# EAGLE schematic A10-A20-OLINUXINO-MICRO-4GB_Rev_D (EAGLE 6.6.0), part 1 of 2
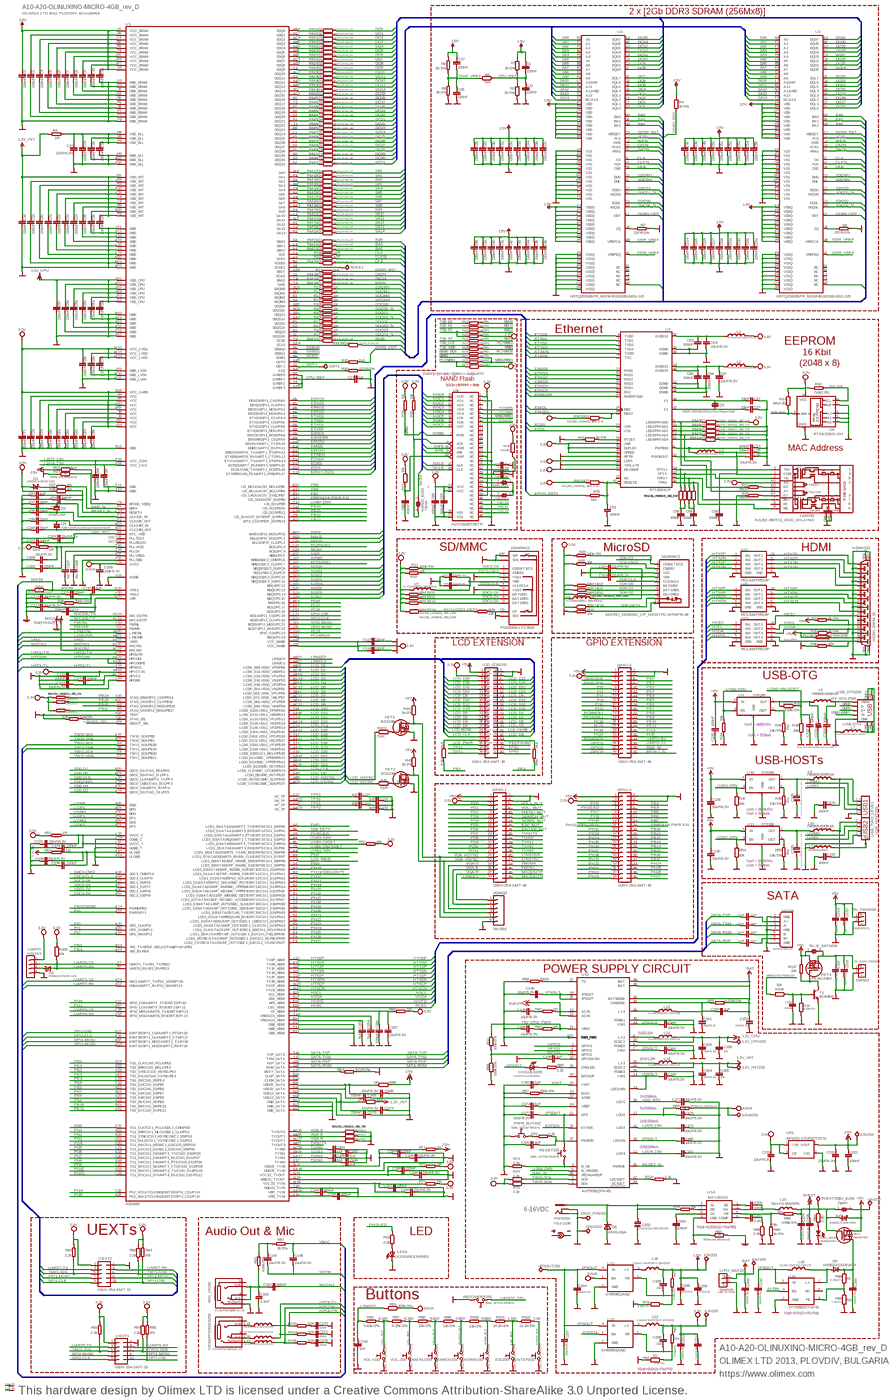
[diagram p0: schematic, sheet 1, overview]
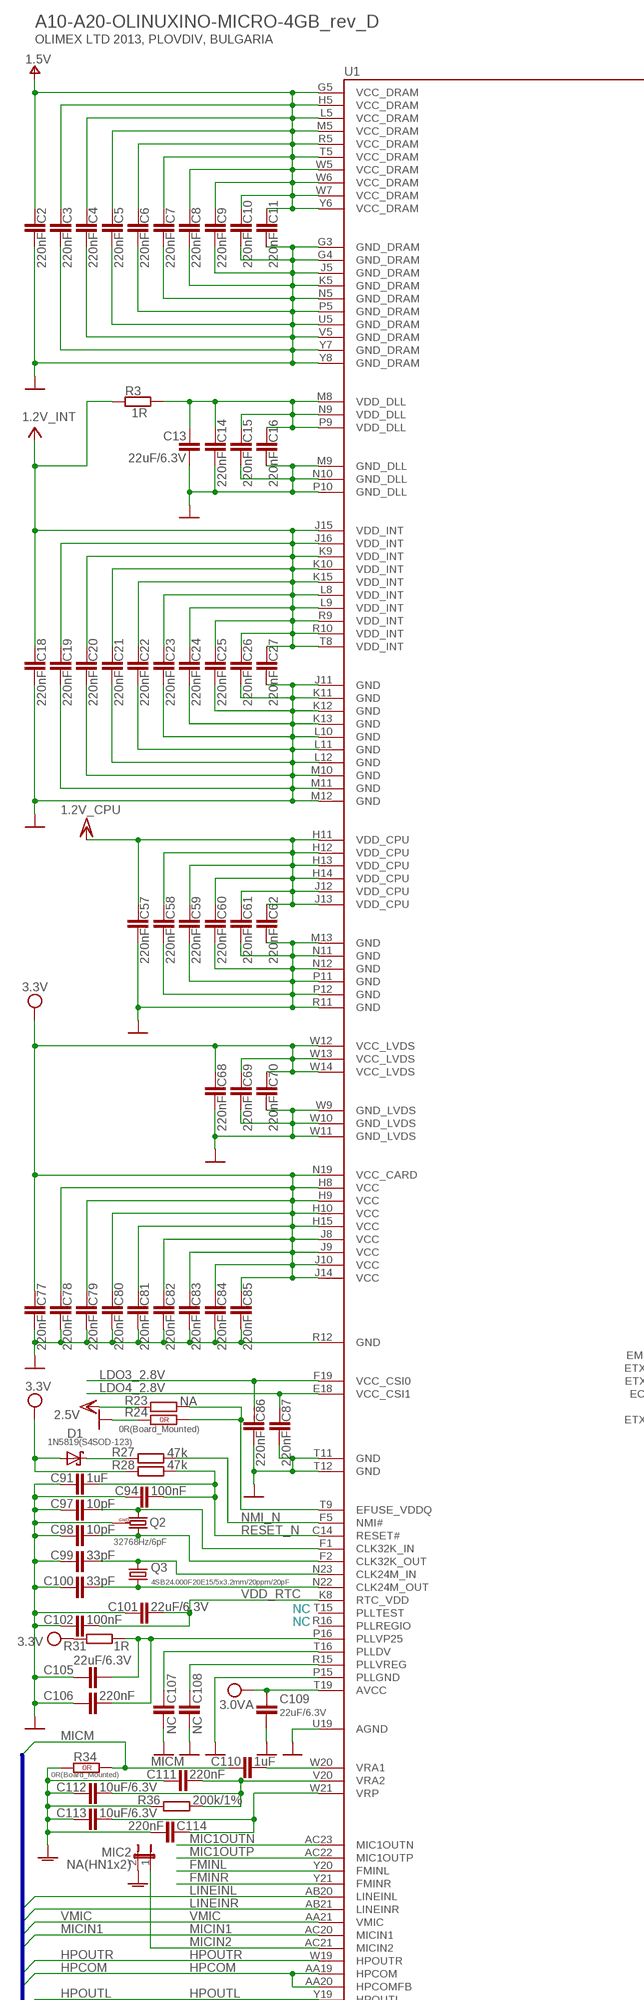
[diagram p1: schematic, sheet 1, part 1 of 4]
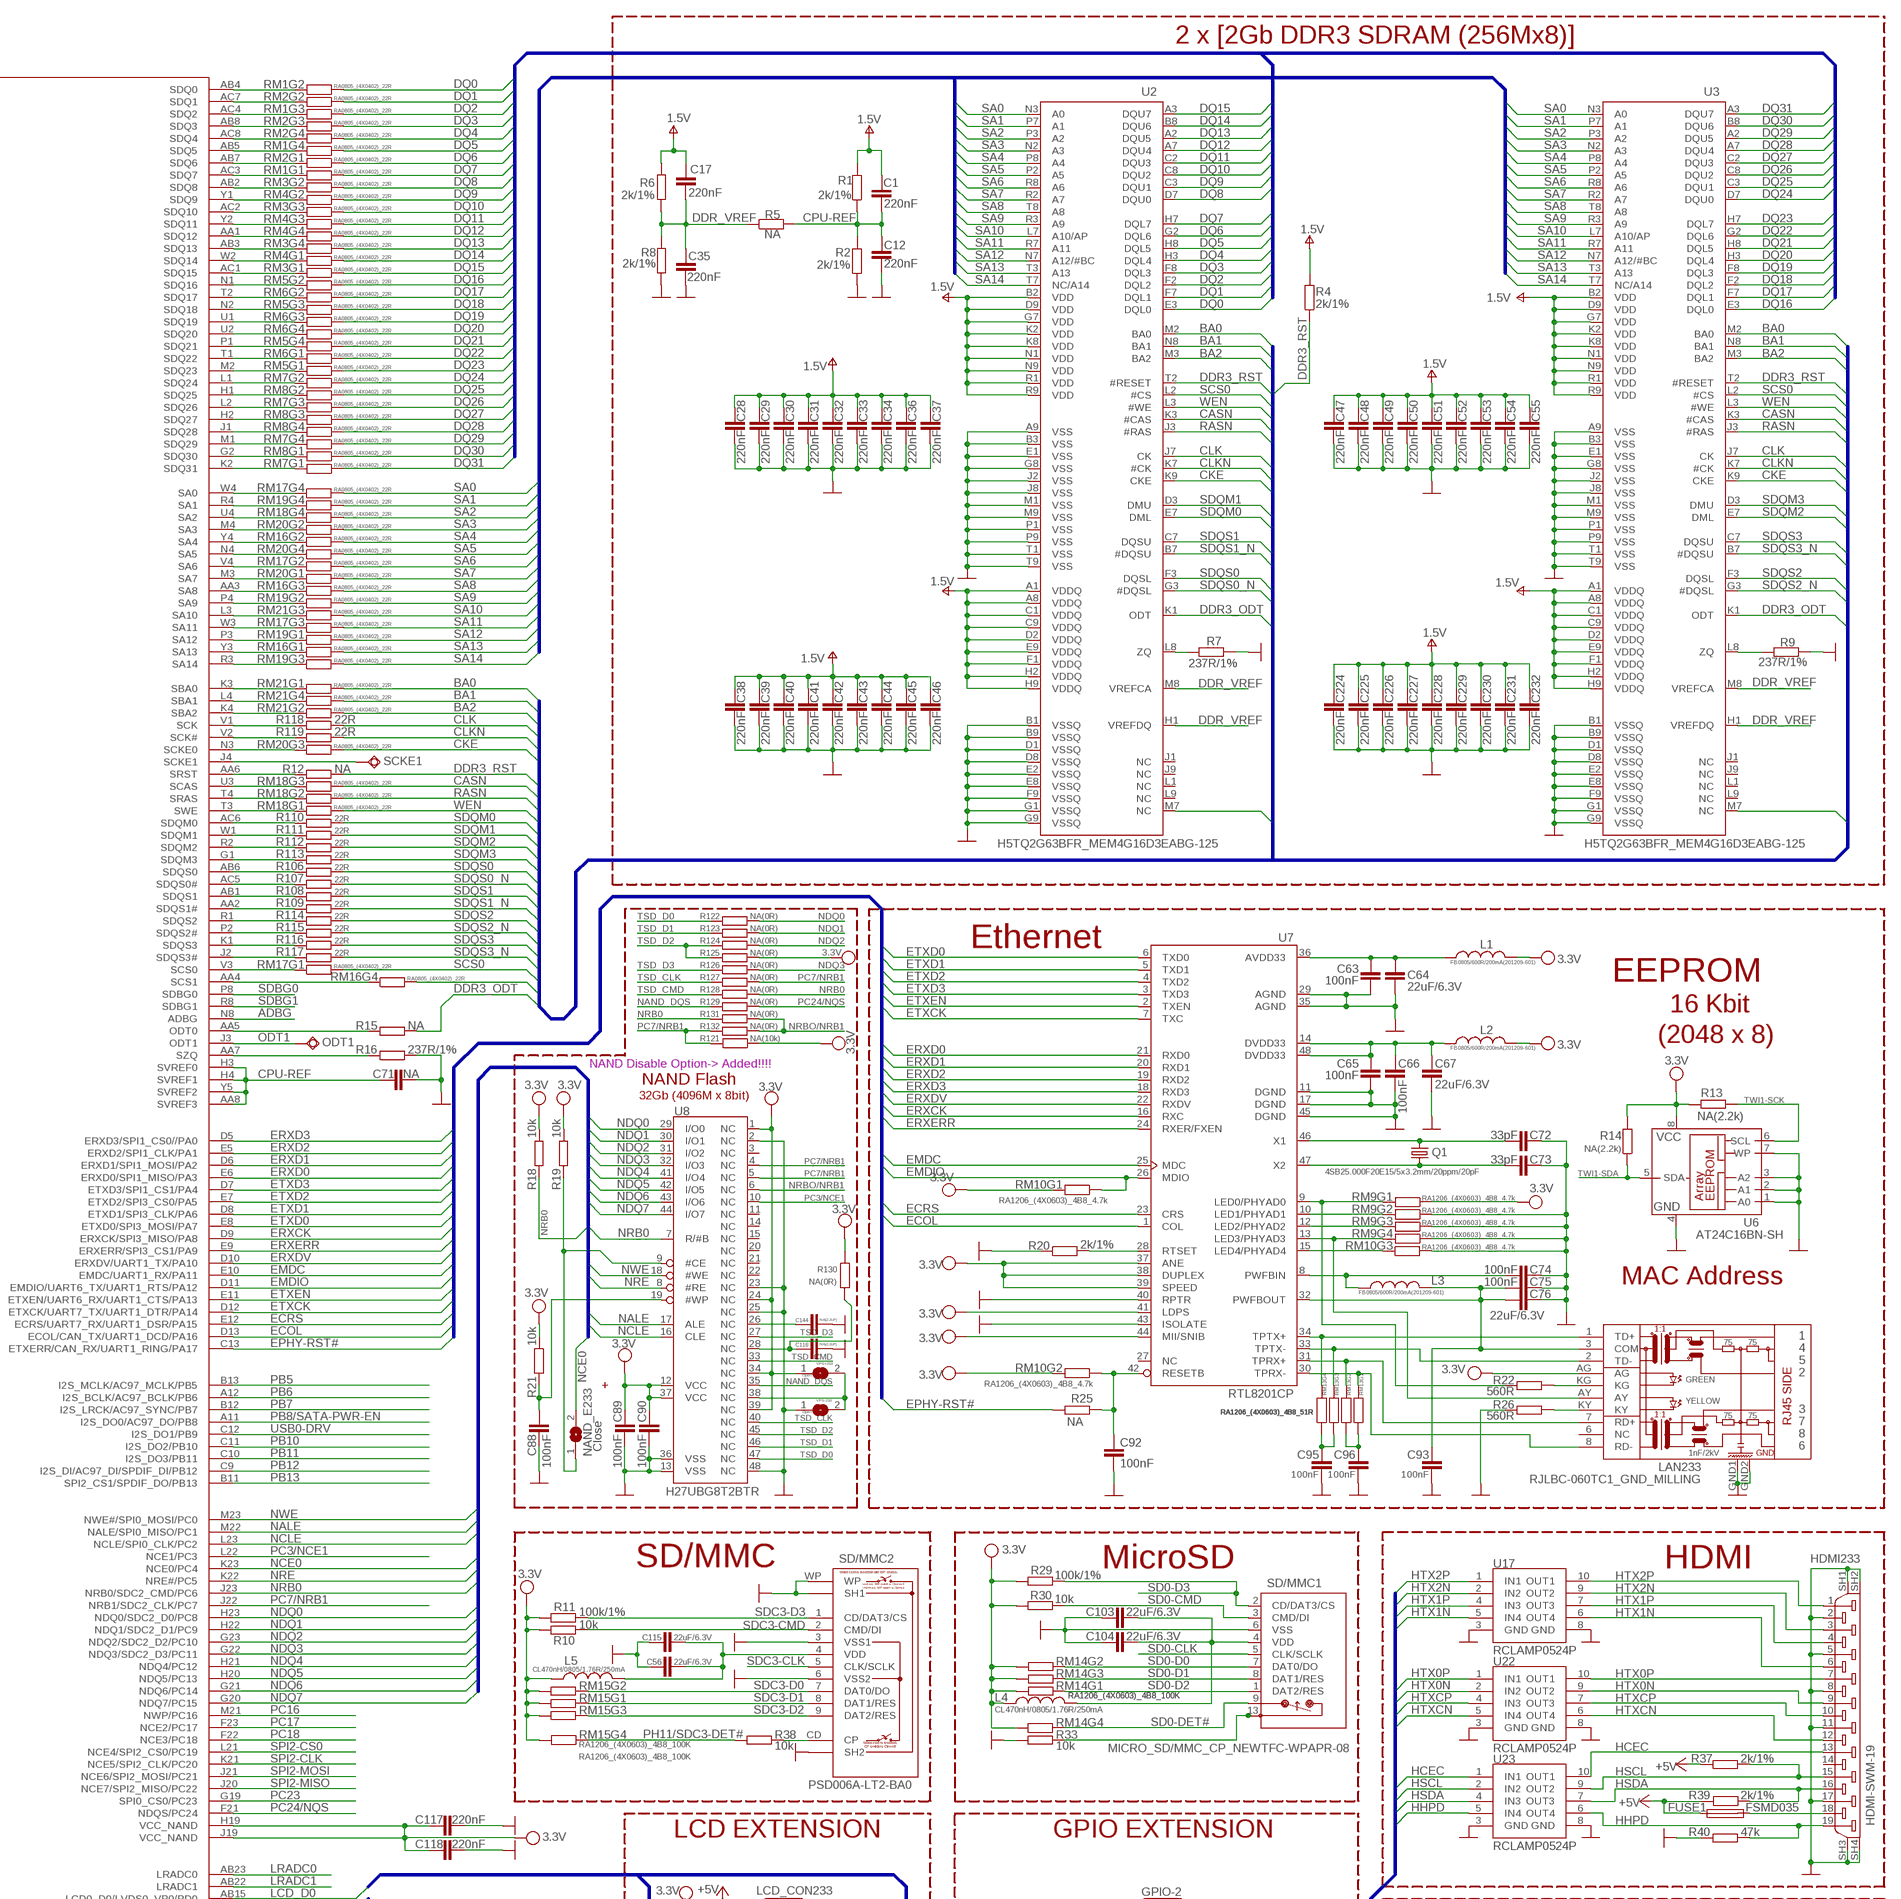
[diagram p2: schematic, sheet 1, part 2 of 4]
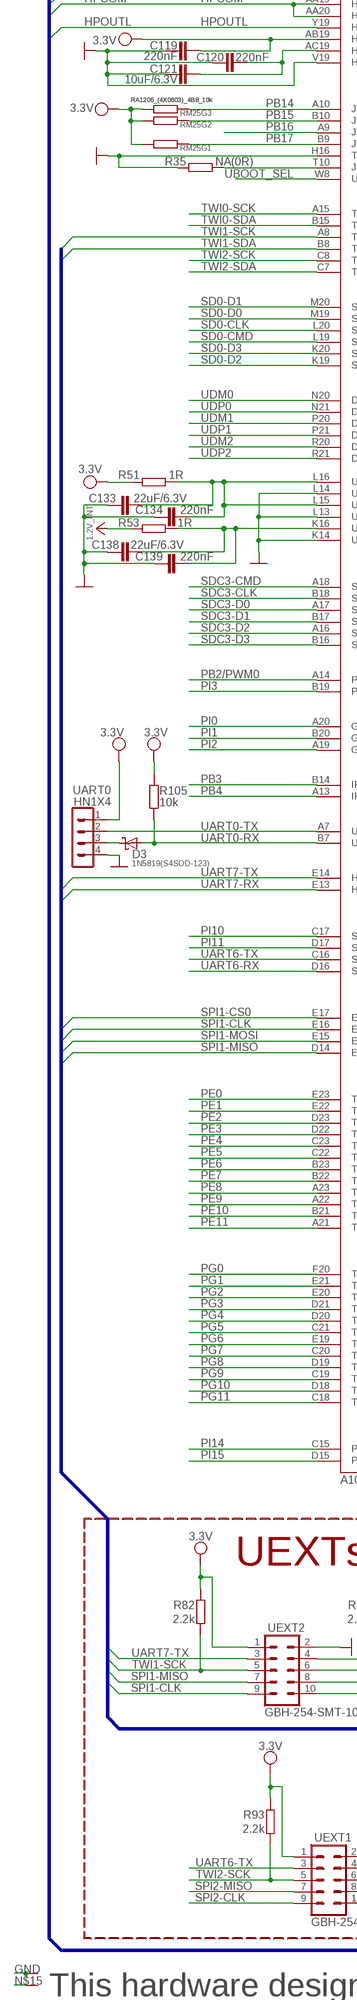
[diagram p3: schematic, sheet 1, part 3 of 4]
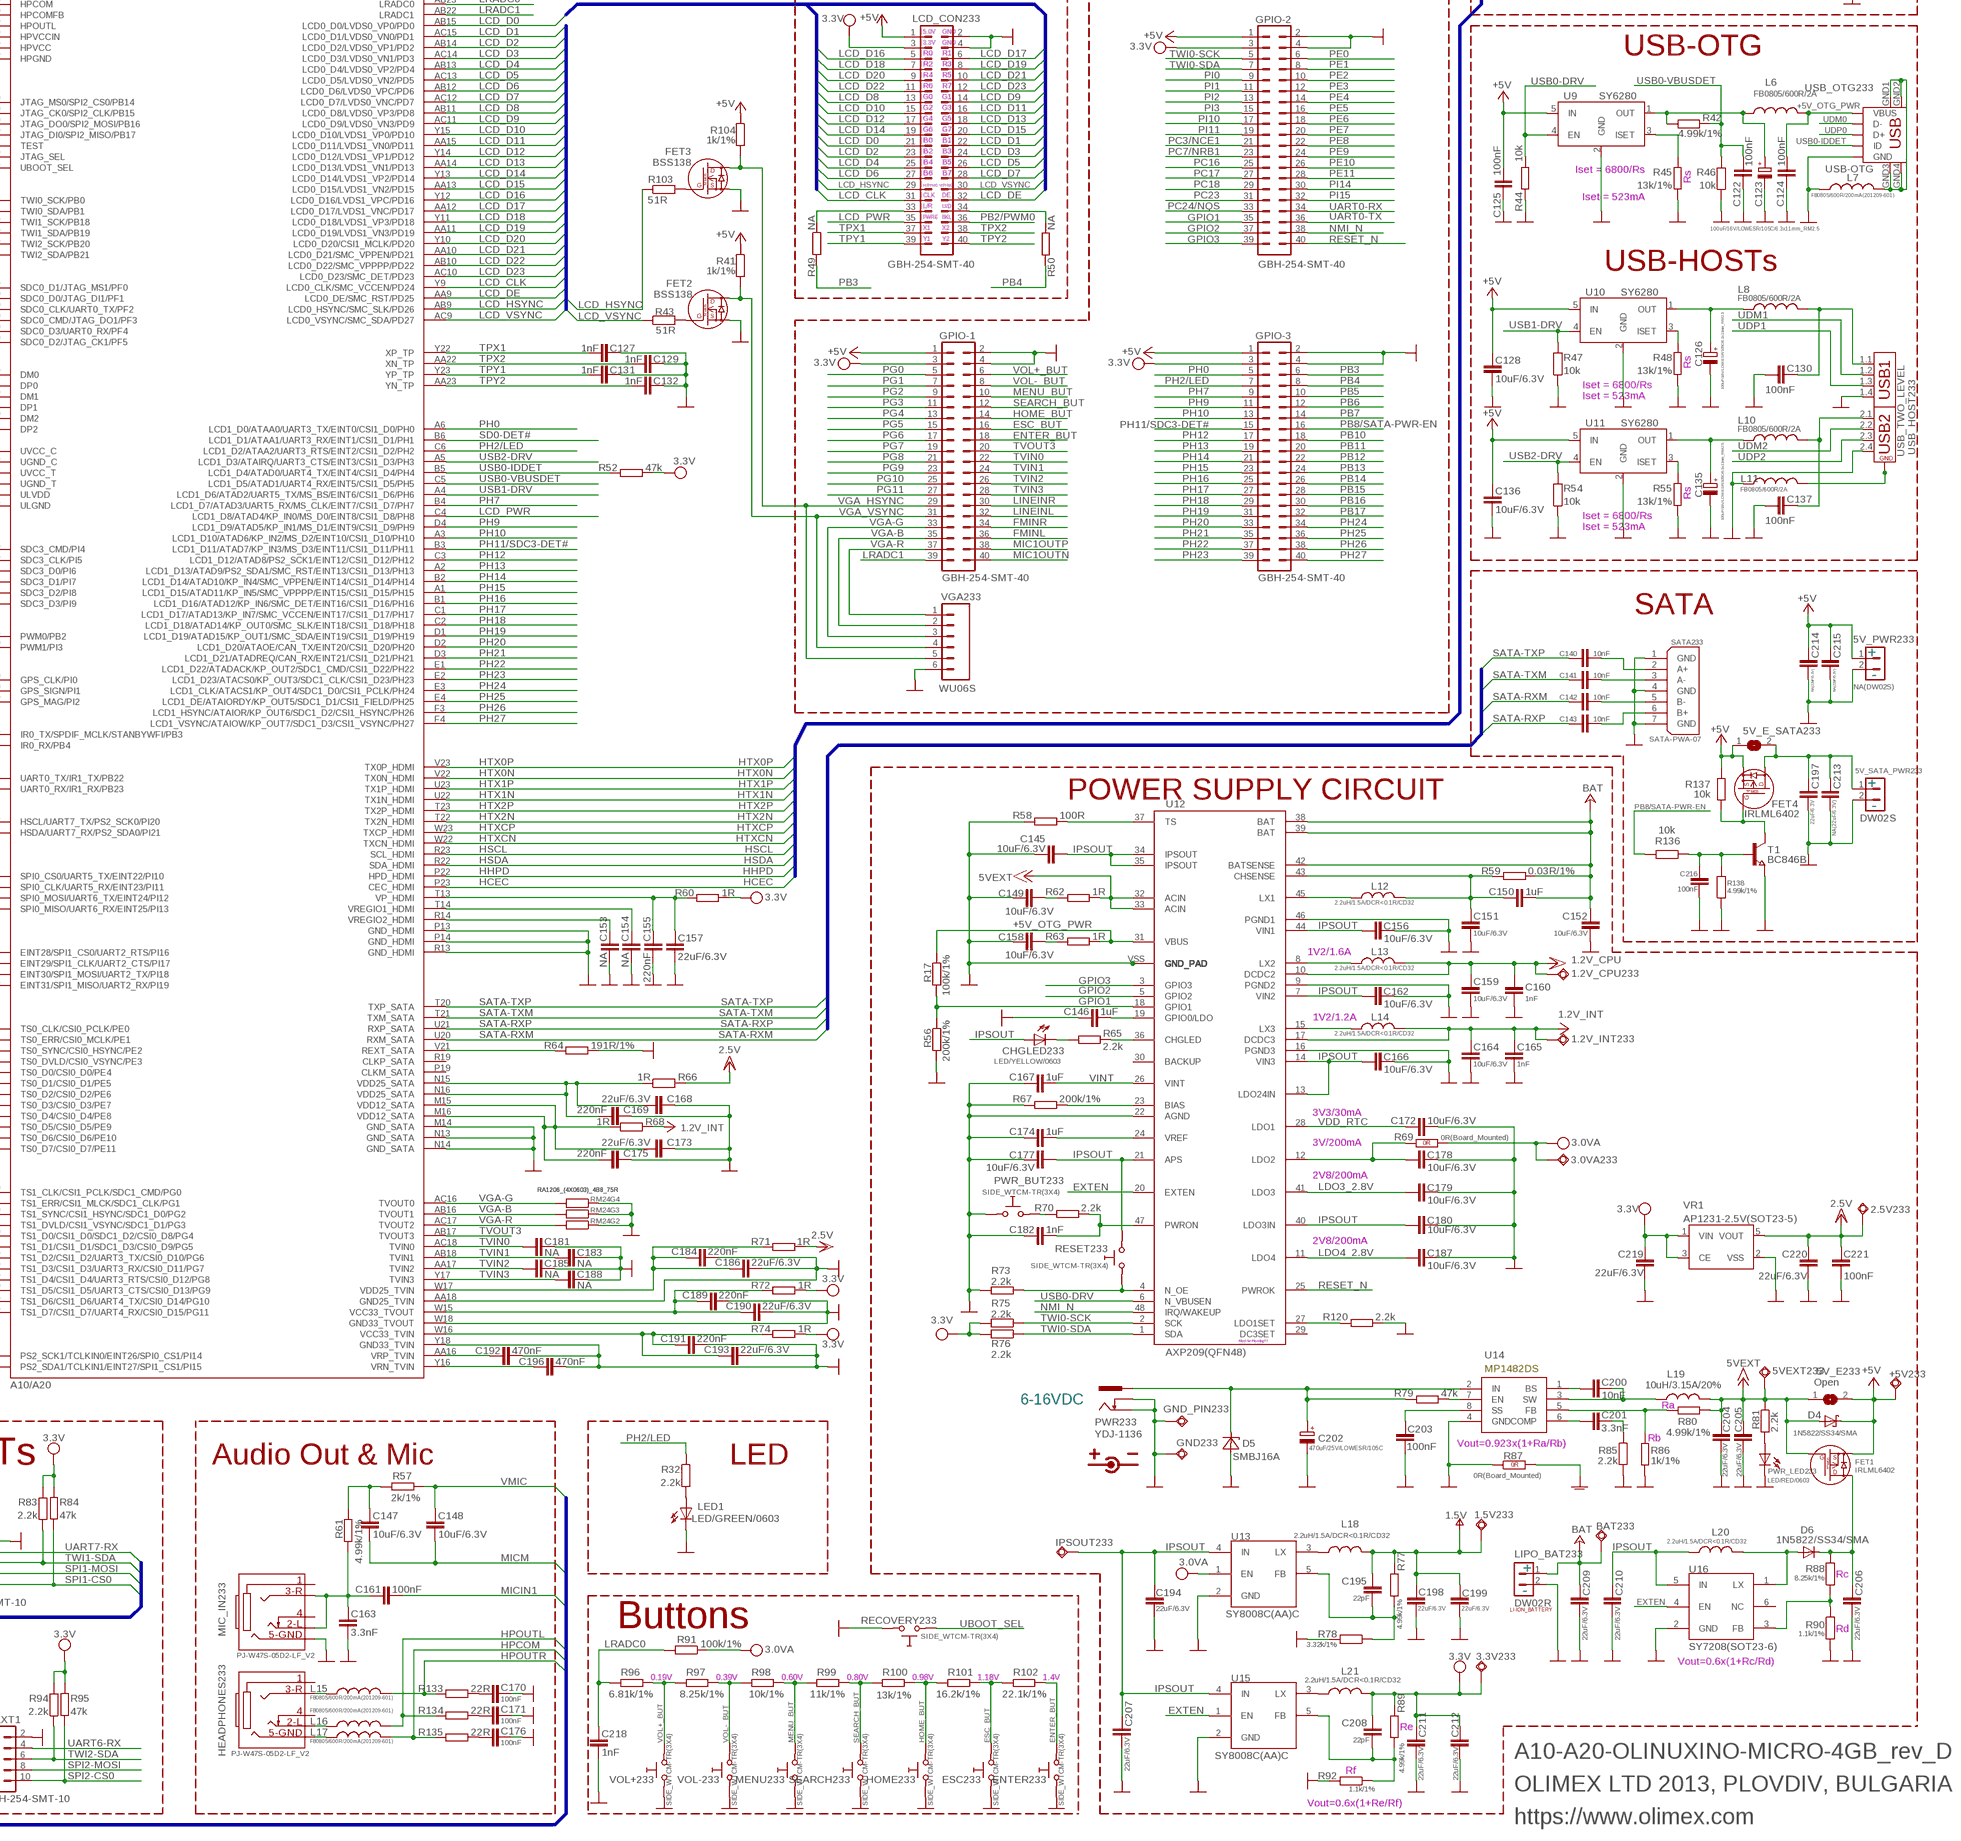
[diagram p4: schematic, sheet 1, part 4 of 4]

## Parts
1.2V_CPU233  TESTPADTESTPAD_40-ROUND  [TESTPAD_40-ROUND]
1.2V_INT233  TESTPADTESTPAD_40-ROUND  [TESTPAD_40-ROUND]
1.5V233  TESTPADTESTPAD_40-ROUND  [TESTPAD_40-ROUND]
2.5V233  TESTPADTESTPAD_40-ROUND  [TESTPAD_40-ROUND]
3.0VA233  TESTPADTESTPAD_40-ROUND  [TESTPAD_40-ROUND]
3.3V233  TESTPADTESTPAD_40-ROUND  [TESTPAD_40-ROUND]
5V_E233  Open  SJSJ_SMALLER  [SJ_1_SMALLER]
5V_E_SATA233  SJSJ_SMALLER  [SJ_1_SMALLER]
5V_PWR233  NA(DW02S)  CON2DW02S  [DW02S]
5V_SATA_PWR233  DW02S  CON2DW02S  [DW02S]
5VEXT233  TESTPADTESTPAD_40-ROUND  [TESTPAD_40-ROUND]
+5V233  TESTPADTESTPAD_40-ROUND  [TESTPAD_40-ROUND]
BAT233  TESTPADTESTPAD_40-ROUND  [TESTPAD_40-ROUND]
C1  220nF  C-EUC0603_DWS  [C0603_DWS]
C2  220nF  C-EUC0402_TI  [C0402_TI]
C3  220nF  C-EUC0402_TI  [C0402_TI]
C4  220nF  C-EUC0603_DWS  [C0603_DWS]
C5  220nF  C-EUC0402_TI  [C0402_TI]
C6  220nF  C-EUC0603_DWS  [C0603_DWS]
C7  220nF  C-EUC0402_TI  [C0402_TI]
C8  220nF  C-EUC0603_DWS  [C0603_DWS]
C9  220nF  C-EUC0603_DWS  [C0603_DWS]
C10  220nF  C-EUC0402_TI  [C0402_TI]
C11  220nF  C-EUC0402_TI  [C0402_TI]
C12  220nF  C-EUC0603_DWS  [C0603_DWS]
C13  22uF/6.3V  C-EUC0603_DWS  [C0603_DWS]
C14  220nF  C-EUC0402_TI  [C0402_TI]
C15  220nF  C-EUC0402_TI  [C0402_TI]
C16  220nF  C-EUC0603_DWS  [C0603_DWS]
C17  220nF  C-EUC0603_DWS  [C0603_DWS]
C18  220nF  C-EUC0402_TI  [C0402_TI]
C19  220nF  C-EUC0402_TI  [C0402_TI]
C20  220nF  C-EUC0603_DWS  [C0603_DWS]
C21  220nF  C-EUC0402_TI  [C0402_TI]
C22  220nF  C-EUC0402_TI  [C0402_TI]
C23  220nF  C-EUC0402_TI  [C0402_TI]
C24  220nF  C-EUC0402_TI  [C0402_TI]
C25  220nF  C-EUC0402_TI  [C0402_TI]
C26  220nF  C-EUC0402_TI  [C0402_TI]
C27  220nF  C-EUC0402_TI  [C0402_TI]
C28  220nF  C-EUC0603_DWS  [C0603_DWS]
C29  220nF  C-EUC0603_DWS  [C0603_DWS]
C30  220nF  C-EUC0603_DWS  [C0603_DWS]
C31  220nF  C-EUC0603_DWS  [C0603_DWS]
C32  220nF  C-EUC0603_DWS  [C0603_DWS]
C33  220nF  C-EUC0603_DWS  [C0603_DWS]
C34  220nF  C-EUC0603_DWS  [C0603_DWS]
C35  220nF  C-EUC0603_DWS  [C0603_DWS]
C36  220nF  C-EUC0603_DWS  [C0603_DWS]
C37  220nF  C-EUC0603_DWS  [C0603_DWS]
C38  220nF  C-EUC0603_DWS  [C0603_DWS]
C39  220nF  C-EUC0603_DWS  [C0603_DWS]
C40  220nF  C-EUC0603_DWS  [C0603_DWS]
C41  220nF  C-EUC0603_DWS  [C0603_DWS]
C42  220nF  C-EUC0603_DWS  [C0603_DWS]
C43  220nF  C-EUC0603_DWS  [C0603_DWS]
C44  220nF  C-EUC0603_DWS  [C0603_DWS]
C45  220nF  C-EUC0603_DWS  [C0603_DWS]
C46  220nF  C-EUC0603_DWS  [C0603_DWS]
C47  220nF  C-EUC0603_DWS  [C0603_DWS]
C48  220nF  C-EUC0603_DWS  [C0603_DWS]
C49  220nF  C-EUC0603_DWS  [C0603_DWS]
C50  220nF  C-EUC0603_DWS  [C0603_DWS]
C51  220nF  C-EUC0603_DWS  [C0603_DWS]
C52  220nF  C-EUC0603_DWS  [C0603_DWS]
C53  220nF  C-EUC0603_DWS  [C0603_DWS]
C54  220nF  C-EUC0603_DWS  [C0603_DWS]
C55  220nF  C-EUC0603_DWS  [C0603_DWS]
C56  22uF/6.3V  C-EUC0603_DWS  [C0603_DWS]
C57  220nF  C-EUC0402_TI  [C0402_TI]
C58  220nF  C-EUC0603_DWS  [C0603_DWS]
C59  220nF  C-EUC0402_TI  [C0402_TI]
C60  220nF  C-EUC0402_TI  [C0402_TI]
C61  220nF  C-EUC0402_TI  [C0402_TI]
C62  220nF  C-EUC0402_TI  [C0402_TI]
C63  100nF  C-EUC0603_DWS  [C0603_DWS]
C64  22uF/6.3V  C-EUC0603_DWS  [C0603_DWS]
C65  100nF  C-EUC0603_DWS  [C0603_DWS]
C66  100nF  C-EUC0603_DWS  [C0603_DWS]
C67  22uF/6.3V  C-EUC0603_DWS  [C0603_DWS]
C68  220nF  C-EUC0402_TI  [C0402_TI]
C69  220nF  C-EUC0402_TI  [C0402_TI]
C70  220nF  C-EUC0402_TI  [C0402_TI]
C71  NA  C-EUC0603_DWS  [C0603_DWS]
C72  33pF  C-EUC0603_DWS  [C0603_DWS]
C73  33pF  C-EUC0603_DWS  [C0603_DWS]
C74  100nF  C-EUC0603_DWS  [C0603_DWS]
C75  100nF  C-EUC0603_DWS  [C0603_DWS]
C76  22uF/6.3V  C-EUC0603_DWS  [C0603_DWS]
C77  220nF  C-EUC0402_TI  [C0402_TI]
C78  220nF  C-EUC0402_TI  [C0402_TI]
C79  220nF  C-EUC0402_TI  [C0402_TI]
C80  220nF  C-EUC0402_TI  [C0402_TI]
C81  220nF  C-EUC0603_DWS  [C0603_DWS]
C82  220nF  C-EUC0402_TI  [C0402_TI]
C83  220nF  C-EUC0402_TI  [C0402_TI]
C84  220nF  C-EUC0402_TI  [C0402_TI]
C85  220nF  C-EUC0402_TI  [C0402_TI]
C86  220nF  C-EUC0402_TI  [C0402_TI]
C87  220nF  C-EUC0402_TI  [C0402_TI]
C88  100nF  C-EUC0603_DWS  [C0603_DWS]
C89  100nF  C-EUC0603_DWS  [C0603_DWS]
C90  100nF  C-EUC0603_DWS  [C0603_DWS]
C91  1uF  C-EUC0603_DWS  [C0603_DWS]
C92  100nF  C-EUC0603_DWS  [C0603_DWS]
C93  100nF  C-EUC0603_DWS  [C0603_DWS]
C94  100nF  C-EUC0603_DWS  [C0603_DWS]
C95  100nF  C-EUC0603_DWS  [C0603_DWS]
C96  100nF  C-EUC0603_DWS  [C0603_DWS]
C97  10pF  C-EUC0603_DWS  [C0603_DWS]
C98  10pF  C-EUC0603_DWS  [C0603_DWS]
C99  33pF  C-EUC0603_DWS  [C0603_DWS]
C100  33pF  C-EUC0603_DWS  [C0603_DWS]
C101  22uF/6.3V  C-EUC0603_DWS  [C0603_DWS]
C102  100nF  C-EUC0402_TI  [C0402_TI]
C103  22uF/6.3V  C-EUC0603_DWS  [C0603_DWS]
C104  22uF/6.3V  C-EUC0603_DWS  [C0603_DWS]
C105  22uF/6.3V  C-EUC0603_DWS  [C0603_DWS]
C106  220nF  C-EUC0402_TI  [C0402_TI]
C107  NC  C-EUC0402_TI  [C0402_TI]
C108  NC  C-EUC0402_TI  [C0402_TI]
C109  22uF/6.3V  C-EUC0603_DWS  [C0603_DWS]
C110  1uF  C-EUC0603_DWS  [C0603_DWS]
C111  220nF  C-EUC0603_DWS  [C0603_DWS]
C112  10uF/6.3V  C-EUC0603_DWS  [C0603_DWS]
C113  10uF/6.3V  C-EUC0603_DWS  [C0603_DWS]
C114  220nF  C-EUC0603_DWS  [C0603_DWS]
C115  22uF/6.3V  C-EUC0603_DWS  [C0603_DWS]
C116  NA(2.2uF)  C-EUC0603_DWS  [C0603_DWS]
C117  220nF  C-EUC0603_DWS  [C0603_DWS]
C118  220nF  C-EUC0603_DWS  [C0603_DWS]
C119  220nF  C-EUC0603_DWS  [C0603_DWS]
C120  220nF  C-EUC0603_DWS  [C0603_DWS]
C121  10uF/6.3V  C-EUC0603_DWS  [C0603_DWS]
C122  100nF  C-EUC0603_DWS  [C0603_DWS]
C123  100uF/16V/LOWESR/105C/6.3x11mm_RM2.5  CPOL-EUE2.5-6.3  [E2,5-6,3]
C124  100nF  C-EUC0603_DWS  [C0603_DWS]
C125  100nF  C-EUC0603_DWS  [C0603_DWS]
C126  100uF/16V/LOWESR/105C/6.3x11mm_RM2.5  CPOL-EUE2.5-6.3  [E2,5-6,3]
C127  1nF  C-EUC0603_DWS  [C0603_DWS]
C128  10uF/6.3V  C-EUC0603_DWS  [C0603_DWS]
C129  1nF  C-EUC0603_DWS  [C0603_DWS]
C130  100nF  C-EUC0603_DWS  [C0603_DWS]
C131  1nF  C-EUC0603_DWS  [C0603_DWS]
C132  1nF  C-EUC0603_DWS  [C0603_DWS]
C133  22uF/6.3V  C-EUC0603_DWS  [C0603_DWS]
C134  220nF  C-EUC0402_TI  [C0402_TI]
C135  100uF/16V/LOWESR/105C/6.3x11mm_RM2.5  CPOL-EUE2.5-6.3  [E2,5-6,3]
C136  10uF/6.3V  C-EUC0603_DWS  [C0603_DWS]
C137  100nF  C-EUC0603_DWS  [C0603_DWS]
C138  22uF/6.3V  C-EUC0603_DWS  [C0603_DWS]
C139  220nF  C-EUC0402_TI  [C0402_TI]
C140  10nF  C-EUC0402_TI  [C0402_TI]
C141  10nF  C-EUC0402_TI  [C0402_TI]
C142  10nF  C-EUC0402_TI  [C0402_TI]
C143  10nF  C-EUC0402_TI  [C0402_TI]
C144  NA(2.2uF)  C-EUC0603_DWS  [C0603_DWS]
C145  10uF/6.3V  C-EUC0603_DWS  [C0603_DWS]
C146  1uF  C-EUC0603_DWS  [C0603_DWS]
C147  10uF/6.3V  C-EUC0603_DWS  [C0603_DWS]
C148  10uF/6.3V  C-EUC0603_DWS  [C0603_DWS]
C149  10uF/6.3V  C-EUC0603_DWS  [C0603_DWS]
C150  1uF  C-EUC0603_DWS  [C0603_DWS]
C151  10uF/6.3V  C-EUC0603_DWS  [C0603_DWS]
C152  10uF/6.3V  C-EUC0603_DWS  [C0603_DWS]
C153  NA  C-EUC0402_TI  [C0402_TI]
C154  NA  C-EUC0402_TI  [C0402_TI]
C155  220nF  C-EUC0402_TI  [C0402_TI]
C156  10uF/6.3V  C-EUC0603_DWS  [C0603_DWS]
C157  22uF/6.3V  C-EUC0603_DWS  [C0603_DWS]
C158  10uF/6.3V  C-EUC0603_DWS  [C0603_DWS]
C159  10uF/6.3V  C-EUC0603_DWS  [C0603_DWS]
C160  1nF  C-EUC0603_DWS  [C0603_DWS]
C161  100nF  C-EUC0603_DWS  [C0603_DWS]
C162  10uF/6.3V  C-EUC0603_DWS  [C0603_DWS]
C163  3.3nF  C-EUC0603_DWS  [C0603_DWS]
C164  10uF/6.3V  C-EUC0603_DWS  [C0603_DWS]
C165  1nF  C-EUC0603_DWS  [C0603_DWS]
C166  10uF/6.3V  C-EUC0603_DWS  [C0603_DWS]
C167  1uF  C-EUC0603_DWS  [C0603_DWS]
C168  22uF/6.3V  C-EUC0603_DWS  [C0603_DWS]
C169  220nF  C-EUC0402_TI  [C0402_TI]
C170  100nF  C-EUC0603_DWS  [C0603_DWS]
C171  100nF  C-EUC0603_DWS  [C0603_DWS]
C172  10uF/6.3V  C-EUC0603_DWS  [C0603_DWS]
C173  22uF/6.3V  C-EUC0603_DWS  [C0603_DWS]
C174  1uF  C-EUC0603_DWS  [C0603_DWS]
C175  220nF  C-EUC0402_TI  [C0402_TI]
C176  100nF  C-EUC0603_DWS  [C0603_DWS]
C177  10uF/6.3V  C-EUC0603_DWS  [C0603_DWS]
C178  10uF/6.3V  C-EUC0603_DWS  [C0603_DWS]
C179  10uF/6.3V  C-EUC0603_DWS  [C0603_DWS]
C180  10uF/6.3V  C-EUC0603_DWS  [C0603_DWS]
C181  NA  C-EUC0603_DWS  [C0603_DWS]
C182  1nF  C-EUC0603_DWS  [C0603_DWS]
C183  NA  C-EUC0603_DWS  [C0603_DWS]
C184  220nF  C-EUC0402_TI  [C0402_TI]
C185  NA  C-EUC0603_DWS  [C0603_DWS]
C186  22uF/6.3V  C-EUC0603_DWS  [C0603_DWS]
C187  10uF/6.3V  C-EUC0603_DWS  [C0603_DWS]
C188  NA  C-EUC0603_DWS  [C0603_DWS]
C189  220nF  C-EUC0402_TI  [C0402_TI]
C190  22uF/6.3V  C-EUC0603_DWS  [C0603_DWS]
C191  220nF  C-EUC0402_TI  [C0402_TI]
C192  470nF  C-EUC0603_DWS  [C0603_DWS]
C193  22uF/6.3V  C-EUC0603_DWS  [C0603_DWS]
C194  22uF/6.3V  C-EUC0603_DWS  [C0603_DWS]
C195  22pF  C-EUC0603_DWS  [C0603_DWS]
C196  470nF  C-EUC0603_DWS  [C0603_DWS]
C197  22uF/6.3V  C-EUC0603_DWS  [C0603_DWS]
C198  22uF/6.3V  C-EUC0603_DWS  [C0603_DWS]
C199  22uF/6.3V  C-EUC0603_DWS  [C0603_DWS]
C200  10nF  C-EUC0402_TI  [C0402_TI]
C201  3.3nF  C-EUC0603_DWS  [C0603_DWS]
C202  470uF/25V/LOWESR/105C  CPOL-EUE5-10.5  [E5-10,5]
C203  100nF  C-EUC0603_DWS  [C0603_DWS]
C204  22uF/6.3V  C-EUC0603_DWS  [C0603_DWS]
C205  22uF/6.3V  C-EUC0603_DWS  [C0603_DWS]
C206  22uF/6.3V  C-EUC0603_DWS  [C0603_DWS]
C207  22uF/6.3V  C-EUC0603_DWS  [C0603_DWS]
C208  22pF  C-EUC0603_DWS  [C0603_DWS]
C209  22uF/6.3V  C-EUC0603_DWS  [C0603_DWS]
C210  22uF/6.3V  C-EUC0603_DWS  [C0603_DWS]
C211  22uF/6.3V  C-EUC0603_DWS  [C0603_DWS]
C212  22uF/6.3V  C-EUC0603_DWS  [C0603_DWS]
C213  NA(22uF/6.3V)  C-EUC0603_DWS  [C0603_DWS]
C214  NA(22uF/6.3V)  C-EUC0603_DWS  [C0603_DWS]
C215  NA(22uF/6.3V)  C-EUC0603_DWS  [C0603_DWS]
C216  100nF  C-EUC0603_DWS  [C0603_DWS]
C218  1nF  C-EUC0603_DWS  [C0603_DWS]
C219  22uF/6.3V  C-EUC0603_DWS  [C0603_DWS]
C220  22uF/6.3V  C-EUC0603_DWS  [C0603_DWS]
C221  100nF  C-EUC0603_DWS  [C0603_DWS]
C224  220nF  C-EUC0603_DWS  [C0603_DWS]
C225  220nF  C-EUC0603_DWS  [C0603_DWS]
C226  220nF  C-EUC0603_DWS  [C0603_DWS]
C227  220nF  C-EUC0603_DWS  [C0603_DWS]
C228  220nF  C-EUC0603_DWS  [C0603_DWS]
C229  220nF  C-EUC0603_DWS  [C0603_DWS]
C230  220nF  C-EUC0603_DWS  [C0603_DWS]
C231  220nF  C-EUC0603_DWS  [C0603_DWS]
C232  220nF  C-EUC0603_DWS  [C0603_DWS]
CHGLED233  LED/YELLOW/0603  LED0603DWS  [LED-0603]
D1  1N5819(S4SOD-123)  SCHOTKKY7.62SS-1N5819(S4SOD-123)  [SOD-123]
D3  1N5819(S4SOD-123)  SCHOTKKY7.62SS-1N5819(S4SOD-123)  [SOD-123]
D4  1N5822/SS34/SMA  SCHOTKKY7.62SS2  [MLL-41]
D5  SMBJ16A  [DO214AA]
D6  1N5822/SS34/SMA  D-MLL-41  [MELF-MLL41]
ENTER233  SIDE_WTCM-TR(3X4)  SW-TAKTSIDE_WTCM-TR(3X4)  [SW_TAKT3X4]
ESC233  SIDE_WTCM-TR(3X4)  SW-TAKTSIDE_WTCM-TR(3X4)  [SW_TAKT3X4]
FET1  IRLML6402  P-MOS+DIODIRLML6402  [SOT23]
FET2  BSS138  N-MOS+DIODBSS138(SOT23-3)  [SOT23]
FET3  BSS138  N-MOS+DIODBSS138(SOT23-3)  [SOT23]
FET4  IRLML6402  P-MOS+DIODIRLML6402  [SOT23]
FUSE1  FSMD035  FUSE  [1206]
GND233  TESTPADTESTPAD_40-ROUND  [TESTPAD_40-ROUND]
GND_PIN233  TESTPAD3  [TEST_PAD40/70/SQUARE]
GPIO-1  GBH-254-SMT-40  ML40-GBH-254-SMT-40  [ML40-MALE(GBH-254-SMT-40)]
GPIO-2  GBH-254-SMT-40  ML40-GBH-254-SMT-40  [ML40-MALE(GBH-254-SMT-40)]
GPIO-3  GBH-254-SMT-40  ML40-GBH-254-SMT-40  [ML40-MALE(GBH-254-SMT-40)]
HDMI233  HDMI-SWM-19  HDMI-MC34931HDMI-SWM-19  [HDMI-SWM-19]
HEADPHONES233  PJ-W47S-05D2-LF_V2  AUDIO_JACK_5PINPJ-W47S-05D2-LF_V2  [PJ-W47S-05D2-LF_5PIN_V2]
HOME233  SIDE_WTCM-TR(3X4)  SW-TAKTSIDE_WTCM-TR(3X4)  [SW_TAKT3X4]
IPSOUT233  TESTPADTESTPAD_40-ROUND  [TESTPAD_40-ROUND]
L1  FB0805/600R/200mA(201209-601)  L-USL0805_5MIL_DWS  [L0805_5MIL_DWS]
L2  FB0805/600R/200mA(201209-601)  L-USL0805_5MIL_DWS  [L0805_5MIL_DWS]
L3  FB0805/600R/200mA(201209-601)  L-USL0805_5MIL_DWS  [L0805_5MIL_DWS]
L4  CL470nH/0805/1.76R/250mA  L-USL0805_5MIL_DWS  [L0805_5MIL_DWS]
L5  CL470nH/0805/1.76R/250mA  L-USL0805_5MIL_DWS  [L0805_5MIL_DWS]
L6  FB0805/600R/2A  L-USL0805_5MIL_DWS  [L0805_5MIL_DWS]
L7  FB0805/600R/200mA(201209-601)  L-USL0805_5MIL_DWS  [L0805_5MIL_DWS]
L8  FB0805/600R/2A  L-USL0805_5MIL_DWS  [L0805_5MIL_DWS]
L10  FB0805/600R/2A  L-USL0805_5MIL_DWS  [L0805_5MIL_DWS]
L11  FB0805/600R/2A  L-USL0805_5MIL_DWS  [L0805_5MIL_DWS]
L12  2.2uH/1.5A/DCR<0.1R/CD32  L-CD32  [CD32]
L13  2.2uH/1.5A/DCR<0.1R/CD32  L-CD32  [CD32]
L14  2.2uH/1.5A/DCR<0.1R/CD32  L-CD32  [CD32]
L15  FB0805/600R/200mA(201209-601)  L-USL0805_5MIL_DWS  [L0805_5MIL_DWS]
L16  FB0805/600R/200mA(201209-601)  L-USL0805_5MIL_DWS  [L0805_5MIL_DWS]
L17  FB0805/600R/200mA(201209-601)  L-USL0805_5MIL_DWS  [L0805_5MIL_DWS]
L18  2.2uH/1.5A/DCR<0.1R/CD32  L-CD32  [CD32]
L19  10uH/3.15A/20%  LLQH88PN100M38  [8X8MM_3131]
L20  2.2uH/1.5A/DCR<0.1R/CD32  L-CD32  [CD32]
L21  2.2uH/1.5A/DCR<0.1R/CD32  L-CD32  [CD32]
LAN233  RJLBC-060TC1_GND_MILLING  [RJLBC-060TC1_MILLING]
LCD_CON233  GBH-254-SMT-40  ML40-GBH-254-SMT-40  [ML40-MALE(GBH-254-SMT-40)]
LED1  LED/GREEN/0603  LED0603DWS  [LED-0603]
LIPO_BAT233  DW02R  CON2DW02R  [DW02R]
MENU233  SIDE_WTCM-TR(3X4)  SW-TAKTSIDE_WTCM-TR(3X4)  [SW_TAKT3X4]
MIC2  NA(HN1x2)  JP1E  [JP1]
MIC_IN233  PJ-W47S-05D2-LF_V2  AUDIO_JACK_5PINPJ-W47S-05D2-LF_V2  [PJ-W47S-05D2-LF_5PIN_V2]
NAND_E233  Close  SJSJ_1_SMALLER_CLOSE_10MILS  [SJ_1_SMALLER_CLOSE_10MILS]
ODT1  TESTPADTESTPAD_40-ROUND  [TESTPAD_40-ROUND]
PWR233  YDJ-1136  PWR-JAKPWR_JACK_UNI_MILLING  [PWR_JACK_UNI_MILLING]
PWR_BUT233  SIDE_WTCM-TR(3X4)  SW-TAKTSIDE_WTCM-TR(3X4)  [SW_TAKT3X4]
PWR_LED233  LED/RED/0603  LED0603DWS  [LED-0603]
Q1  4SB25.000F20E15/5x3.2mm/20ppm/20pF  HC49/S_E4SB25.000F20E15  [HCX-4S]
Q2  32768Hz/6pF  Q_GND1  [TC26H_3_REPAIR_SMD]
Q3  4SB24.000F20E15/5x3.2mm/20ppm/20pF  HC49/S_E4SB25.000F20E15  [HCX-4S]
R1  2k/1%  R-EU_R0603_5MIL_DWS  [R0603_5MIL_DWS]
R2  2k/1%  R-EU_R0603_5MIL_DWS  [R0603_5MIL_DWS]
R3  1R  R-EU_R0603_5MIL_DWS  [R0603_5MIL_DWS]
R4  2k/1%  R-EU_R0603_5MIL_DWS  [R0603_5MIL_DWS]
R5  NA  R-EU_R0603_5MIL_DWS  [R0603_5MIL_DWS]
R6  2k/1%  R-EU_R0603_5MIL_DWS  [R0603_5MIL_DWS]
R7  237R/1%  R-EU_R0603_5MIL_DWS  [R0603_5MIL_DWS]
R8  2k/1%  R-EU_R0603_5MIL_DWS  [R0603_5MIL_DWS]
R9  237R/1%  R-EU_R0603_5MIL_DWS  [R0603_5MIL_DWS]
R10  10k  R-EU_R0603_5MIL_DWS  [R0603_5MIL_DWS]
R11  100k/1%  R-EU_R0603_5MIL_DWS  [R0603_5MIL_DWS]
R12  NA  R-EU_R0402_TI  [R0402_TI]
R13  NA(2.2k)  R-EU_R0603_5MIL_DWS  [R0603_5MIL_DWS]
R14  NA(2.2k)  R-EU_R0603_5MIL_DWS  [R0603_5MIL_DWS]
R15  NA  R-EU_R0402_TI  [R0402_TI]
R16  237R/1%  R-EU_R0603_5MIL_DWS  [R0603_5MIL_DWS]
R17  100k/1%  R-EU_R0603_5MIL_DWS  [R0603_5MIL_DWS]
R18  10k  R-EU_R0603_5MIL_DWS  [R0603_5MIL_DWS]
R19  10k  R-EU_R0603_5MIL_DWS  [R0603_5MIL_DWS]
R20  2k/1%  R-EU_R0603_5MIL_DWS  [R0603_5MIL_DWS]
R21  10k  R-EU_R0603_5MIL_DWS  [R0603_5MIL_DWS]
R22  560R  R-EU_R0603_5MIL_DWS  [R0603_5MIL_DWS]
R23  NA  R-EU_R0603_5MIL_DWS  [R0603_5MIL_DWS]
R24  0R(Board_Mounted)  R_0R0R(NA)  [0603_0R]
R25  NA  R-EU_R0603_5MIL_DWS  [R0603_5MIL_DWS]
R26  560R  R-EU_R0603_5MIL_DWS  [R0603_5MIL_DWS]
R27  47k  R-EU_R0603_5MIL_DWS  [R0603_5MIL_DWS]
R28  47k  R-EU_R0603_5MIL_DWS  [R0603_5MIL_DWS]
R29  100k/1%  R-EU_R0603_5MIL_DWS  [R0603_5MIL_DWS]
R30  10k  R-EU_R0603_5MIL_DWS  [R0603_5MIL_DWS]
R31  1R  R-EU_R0603_5MIL_DWS  [R0603_5MIL_DWS]
R32  2.2k  R-EU_R0603_5MIL_DWS  [R0603_5MIL_DWS]
R33  10k  R-EU_R0603_5MIL_DWS  [R0603_5MIL_DWS]
R34  0R(Board_Mounted)  R_0R0R(NA)  [0603_0R]
R35  NA(0R)  R-EU_R0603_5MIL_DWS  [R0603_5MIL_DWS]
R36  200k/1%  R-EU_R0603_5MIL_DWS  [R0603_5MIL_DWS]
R37  2k/1%  R-EU_R0603_5MIL_DWS  [R0603_5MIL_DWS]
R38  10k  R-EU_R0603_5MIL_DWS  [R0603_5MIL_DWS]
R39  2k/1%  R-EU_R0603_5MIL_DWS  [R0603_5MIL_DWS]
R40  47k  R-EU_R0603_5MIL_DWS  [R0603_5MIL_DWS]
R41  1k/1%  R-EU_R0603_5MIL_DWS  [R0603_5MIL_DWS]
R42  4.99k/1%  R-EU_R0603_5MIL_DWS  [R0603_5MIL_DWS]
R43  51R  R-EU_R0603_5MIL_DWS  [R0603_5MIL_DWS]
R44  10k  R-EU_R0603_5MIL_DWS  [R0603_5MIL_DWS]
R45  13k/1%  R-EU_R0603_5MIL_DWS  [R0603_5MIL_DWS]
R46  10k  R-EU_R0603_5MIL_DWS  [R0603_5MIL_DWS]
R47  10k  R-EU_R0603_5MIL_DWS  [R0603_5MIL_DWS]
R48  13k/1%  R-EU_R0603_5MIL_DWS  [R0603_5MIL_DWS]
R49  NA  R-EU_R0603_5MIL_DWS  [R0603_5MIL_DWS]
R50  NA  R-EU_R0603_5MIL_DWS  [R0603_5MIL_DWS]
R51  1R  R-EU_R0603_5MIL_DWS  [R0603_5MIL_DWS]
R52  47k  R-EU_R0603_5MIL_DWS  [R0603_5MIL_DWS]
R53  1R  R-EU_R0603_5MIL_DWS  [R0603_5MIL_DWS]
R54  10k  R-EU_R0603_5MIL_DWS  [R0603_5MIL_DWS]
R55  13k/1%  R-EU_R0603_5MIL_DWS  [R0603_5MIL_DWS]
R56  200k/1%  R-EU_R0603_5MIL_DWS  [R0603_5MIL_DWS]
R57  2k/1%  R-EU_R0603_5MIL_DWS  [R0603_5MIL_DWS]
R58  100R  R-EU_R0603_5MIL_DWS  [R0603_5MIL_DWS]
R59  0.03R/1%  R-EU_R1206_5MIL_WS  [R1206_5MIL_WS]
R60  1R  R-EU_R0603_5MIL_DWS  [R0603_5MIL_DWS]
R61  4.99k/1%  R-EU_R0603_5MIL_DWS  [R0603_5MIL_DWS]
R62  1R  R-EU_R0603_5MIL_DWS  [R0603_5MIL_DWS]
R63  1R  R-EU_R0603_5MIL_DWS  [R0603_5MIL_DWS]
R64  191R/1%  R-EU_R0603_5MIL_DWS  [R0603_5MIL_DWS]
R65  2.2k  R-EU_R0603_5MIL_DWS  [R0603_5MIL_DWS]
R66  1R  R-EU_R0603_5MIL_DWS  [R0603_5MIL_DWS]
R67  200k/1%  R-EU_R0603_5MIL_DWS  [R0603_5MIL_DWS]
R68  1R  R-EU_R0603_5MIL_DWS  [R0603_5MIL_DWS]
R69  0R(Board_Mounted)  R_0R0R(NA)  [0603_0R]
R70  2.2k  R-EU_R0603_5MIL_DWS  [R0603_5MIL_DWS]
R71  1R  R-EU_R0603_5MIL_DWS  [R0603_5MIL_DWS]
R72  1R  R-EU_R0603_5MIL_DWS  [R0603_5MIL_DWS]
R73  2.2k  R-EU_R0603_5MIL_DWS  [R0603_5MIL_DWS]
R74  1R  R-EU_R0603_5MIL_DWS  [R0603_5MIL_DWS]
R75  2.2k  R-EU_R0603_5MIL_DWS  [R0603_5MIL_DWS]
R76  2.2k  R-EU_R0603_5MIL_DWS  [R0603_5MIL_DWS]
R77  4.99k/1%  R-EU_R0603_5MIL_DWS  [R0603_5MIL_DWS]
R78  3.32k/1%  R-EU_R0603_5MIL_DWS  [R0603_5MIL_DWS]
R79  47k  R-EU_R0603_5MIL_DWS  [R0603_5MIL_DWS]
R80  4.99k/1%  R-EU_R0603_5MIL_DWS  [R0603_5MIL_DWS]
R81  2.2k  R-EU_R0603_5MIL_DWS  [R0603_5MIL_DWS]
R82  2.2k  R-EU_R0603_5MIL_DWS  [R0603_5MIL_DWS]
R83  2.2k  R-EU_R0603_5MIL_DWS  [R0603_5MIL_DWS]
R84  47k  R-EU_R0603_5MIL_DWS  [R0603_5MIL_DWS]
R85  2.2k  R-EU_R0603_5MIL_DWS  [R0603_5MIL_DWS]
R86  1k/1%  R-EU_R0603_5MIL_DWS  [R0603_5MIL_DWS]
R87  0R(Board_Mounted)  R_0R0R(NA)  [0603_0R]
R88  8.25k/1%  R-EU_R0603_5MIL_DWS  [R0603_5MIL_DWS]
R89  4.99k/1%  R-EU_R0603_5MIL_DWS  [R0603_5MIL_DWS]
R90  1.1k/1%  R-EU_R0603_5MIL_DWS  [R0603_5MIL_DWS]
R91  100k/1%  R-EU_R0603_5MIL_DWS  [R0603_5MIL_DWS]
R92  1.1k/1%  R-EU_R0603_5MIL_DWS  [R0603_5MIL_DWS]
R93  2.2k  R-EU_R0603_5MIL_DWS  [R0603_5MIL_DWS]
R94  2.2k  R-EU_R0603_5MIL_DWS  [R0603_5MIL_DWS]
R95  47k  R-EU_R0603_5MIL_DWS  [R0603_5MIL_DWS]
R96  6.81k/1%  R-EU_R0603_5MIL_DWS  [R0603_5MIL_DWS]
R97  8.25k/1%  R-EU_R0603_5MIL_DWS  [R0603_5MIL_DWS]
R98  10k/1%  R-EU_R0603_5MIL_DWS  [R0603_5MIL_DWS]
R99  11k/1%  R-EU_R0603_5MIL_DWS  [R0603_5MIL_DWS]
R100  13k/1%  R-EU_R0603_5MIL_DWS  [R0603_5MIL_DWS]
R101  16.2k/1%  R-EU_R0603_5MIL_DWS  [R0603_5MIL_DWS]
R102  22.1k/1%  R-EU_R0603_5MIL_DWS  [R0603_5MIL_DWS]
R103  51R  R-EU_R0603_5MIL_DWS  [R0603_5MIL_DWS]
R104  1k/1%  R-EU_R0603_5MIL_DWS  [R0603_5MIL_DWS]
R105  10k  R-EU_R0603_5MIL_DWS  [R0603_5MIL_DWS]
R106  22R  R-EU_R0402_TI  [R0402_TI]
R107  22R  R-EU_R0402_TI  [R0402_TI]
R108  22R  R-EU_R0402_TI  [R0402_TI]
R109  22R  R-EU_R0402_TI  [R0402_TI]
R110  22R  R-EU_R0402_TI  [R0402_TI]
R111  22R  R-EU_R0402_TI  [R0402_TI]
R112  22R  R-EU_R0402_TI  [R0402_TI]
R113  22R  R-EU_R0402_TI  [R0402_TI]
R114  22R  R-EU_R0402_TI  [R0402_TI]
R115  22R  R-EU_R0402_TI  [R0402_TI]
R116  22R  R-EU_R0402_TI  [R0402_TI]
R117  22R  R-EU_R0402_TI  [R0402_TI]
R118  22R  R-EU_R0402_TI  [R0402_TI]
R119  22R  R-EU_R0402_TI  [R0402_TI]
R120  2.2k  R-EU_R0603_5MIL_DWS  [R0603_5MIL_DWS]
R121  NA(10k)  R-EU_R0603_5MIL_DWS  [R0603_5MIL_DWS]
R122  NA(0R)  R-EU_R0402_TI  [R0402_TI]
R123  NA(0R)  R-EU_R0402_TI  [R0402_TI]
R124  NA(0R)  R-EU_R0402_TI  [R0402_TI]
R125  NA(0R)  R-EU_R0402_TI  [R0402_TI]
R126  NA(0R)  R-EU_R0402_TI  [R0402_TI]
R127  NA(0R)  R-EU_R0402_TI  [R0402_TI]
R128  NA(0R)  R-EU_R0402_TI  [R0402_TI]
R129  NA(0R)  R-EU_R0402_TI  [R0402_TI]
R130  NA(0R)  R-EU_R0402_TI  [R0402_TI]
R131  NA(0R)  R-EU_R0402_TI  [R0402_TI]
R132  NA(0R)  R-EU_R0402_TI  [R0402_TI]
R133  22R  R-EU_R0402_TI  [R0402_TI]
R134  22R  R-EU_R0402_TI  [R0402_TI]
R135  22R  R-EU_R0402_TI  [R0402_TI]
R136  10k  R-EU_R0603_5MIL_DWS  [R0603_5MIL_DWS]
R137  10k  R-EU_R0603_5MIL_DWS  [R0603_5MIL_DWS]
R138  4.99k/1%  R-EU_R0603_5MIL_DWS  [R0603_5MIL_DWS]
RECOVERY233  SIDE_WTCM-TR(3X4)  SW-TAKTSIDE_WTCM-TR(3X4)  [SW_TAKT3X4]
RESET233  SIDE_WTCM-TR(3X4)  SW-TAKTSIDE_WTCM-TR(3X4)  [SW_TAKT3X4]
RM1  RA0805_(4X0402)_22R  R_MATRIX_4E_25X625  [R_MATRIX_4_0402_25X625]
RM2  RA0805_(4X0402)_22R  R_MATRIX_4E_25X625  [R_MATRIX_4_0402_25X625]
RM3  RA0805_(4X0402)_22R  R_MATRIX_4E_25X625  [R_MATRIX_4_0402_25X625]
RM4  RA0805_(4X0402)_22R  R_MATRIX_4E_25X625  [R_MATRIX_4_0402_25X625]
RM5  RA0805_(4X0402)_22R  R_MATRIX_4E_25X625  [R_MATRIX_4_0402_25X625]
RM6  RA0805_(4X0402)_22R  R_MATRIX_4E_25X625  [R_MATRIX_4_0402_25X625]
RM7  RA0805_(4X0402)_22R  R_MATRIX_4E_25X625  [R_MATRIX_4_0402_25X625]
RM8  RA0805_(4X0402)_22R  R_MATRIX_4E_25X625  [R_MATRIX_4_0402_25X625]
RM9  RA1206_(4X0603)_4B8_4.7k  R_MATRIX_4E  [R_MATRIX_4]
RM10  RA1206_(4X0603)_4B8_4.7k  R_MATRIX_4E  [R_MATRIX_4]
RM13  RA1206_(4X0603)_4B8_51R  R_MATRIX_4E  [R_MATRIX_4]
RM14  RA1206_(4X0603)_4B8_100K  R_MATRIX_4E  [R_MATRIX_4]
RM15  RA1206_(4X0603)_4B8_100K  R_MATRIX_4E  [R_MATRIX_4]
RM16  RA0805_(4X0402)_22R  R_MATRIX_4E_25X625  [R_MATRIX_4_0402_25X625]
RM17  RA0805_(4X0402)_22R  R_MATRIX_4E_25X625  [R_MATRIX_4_0402_25X625]
RM18  RA0805_(4X0402)_22R  R_MATRIX_4E_25X625  [R_MATRIX_4_0402_25X625]
RM19  RA0805_(4X0402)_22R  R_MATRIX_4E_25X625  [R_MATRIX_4_0402_25X625]
RM20  RA0805_(4X0402)_22R  R_MATRIX_4E_25X625  [R_MATRIX_4_0402_25X625]
RM21  RA0805_(4X0402)_22R  R_MATRIX_4E_25X625  [R_MATRIX_4_0402_25X625]
RM24  RA1206_(4X0603)_4B8_75R  R_MATRIX_4E  [R_MATRIX_4]
RM25  RA1206_(4X0603)_4B8_10k  R_MATRIX_4E  [R_MATRIX_4]
SATA233  SATA-PWA-07  [SATA-PWA-07]
SCKE1  TESTPADTESTPAD_40-ROUND  [TESTPAD_40-ROUND]
SD/MMC1  MICRO_SD/MMC_CP_NEWTFC-WPAPR-08  [TFC-WPAPR-08]
SD/MMC2  PSD006A-LT2-BA0  SD_CARD_PSD006A-LT2-BA0  [SD_CARD]
SEARCH233  SIDE_WTCM-TR(3X4)  SW-TAKTSIDE_WTCM-TR(3X4)  [SW_TAKT3X4]
T1  BC846B  NPN-TRANSISTOR_SOT23  [SOT23]
U1  A10/A20  A10  [TFBGA441]
U2  H5TQ2G63BFR_MEM4G16D3EABG-125  H5TQ2G63BFR_MEM4G16D3EABG-125PHIS  [FBGA96_MEM]
U3  H5TQ2G63BFR_MEM4G16D3EABG-125  H5TQ2G63BFR_MEM4G16D3EABG-125PHIS  [FBGA96_MEM]
U6  AT24C16BN-SH  24LCXX  [SO-08MN]
U7  RTL8201CP  [LQFP48]
U8  H27UBG8T2BTR  H27UBG8T2A  [TSOP48]
U9  SY6280  [SOT23-5]
U10  SY6280  [SOT23-5]
U11  SY6280  [SOT23-5]
U12  AXP209(QFN48)  AXP209  [QFN48]
U13  SY8008C(AA)C  SY8008  [SOT23-5]
U14  MP1482DS  MP1482  [SOIC8]
U15  SY8008C(AA)C  SY8008  [SOT23-5]
U16  SY7208(SOT23-6)  SY7208  [SOT23-6]
U17  RCLAMP0524P  [SLP2510P8]
U22  RCLAMP0524P  [SLP2510P8]
U23  RCLAMP0524P  [SLP2510P8]
UART0  HN1X4  CON4HN1X4  [HN1X4]
UEXT1  GBH-254-SMT-10  ML10MD  [ML10_S]
UEXT2  GBH-254-SMT-10  ML10MD  [ML10_S]
USB_HOST233  USB_TWO_LEVEL  [USB_TWO_LEVEL]
USB_OTG233  USB-OTG  MINI_USB9  [USB_MINI_9PIN]
VGA233  WU06S  CON6  [CON1.27MM-6-SMALL_ICSP]
VOL+233  SIDE_WTCM-TR(3X4)  SW-TAKTSIDE_WTCM-TR(3X4)  [SW_TAKT3X4]
VOL-233  SIDE_WTCM-TR(3X4)  SW-TAKTSIDE_WTCM-TR(3X4)  [SW_TAKT3X4]
VP_0  VPDEV0  [VPAC0]
VP_1  VPDEV0  [VPAC0]
VP_2  VPDEV0  [VPAC0]
VP_3  VPDEV0  [VPAC0]
VP_4  VPDEV0  [VPAC0]
VP_5  VPDEV0  [VPAC0]
VP_6  VPDEV0  [VPAC0]
VP_7  VPDEV0  [VPAC0]
VP_8  VPDEV1  [VPAC1]
VP_9  VPDEV0  [VPAC0]
VP_10  VPDEV0  [VPAC0]
VP_11  VPDEV0  [VPAC0]
VP_12  VPDEV0  [VPAC0]
VP_13  VPDEV0  [VPAC0]
VP_14  VPDEV0  [VPAC0]
VP_15  VPDEV0  [VPAC0]
VP_16  VPDEV0  [VPAC0]
VP_17  VPDEV1  [VPAC1]
VP_18  VPDEV0  [VPAC0]
VP_19  VPDEV0  [VPAC0]
VP_20  VPDEV0  [VPAC0]
VP_21  VPDEV0  [VPAC0]
VP_22  VPDEV0  [VPAC0]
VP_23  VPDEV0  [VPAC0]
VP_24  VPDEV0  [VPAC0]
VP_25  VPDEV0  [VPAC0]
VP_26  VPDEV1  [VPAC1]
VP_27  VPDEV0  [VPAC0]
VP_28  VPDEV0  [VPAC0]
VP_29  VPDEV0  [VPAC0]
VP_30  VPDEV0  [VPAC0]
VP_31  VPDEV0  [VPAC0]
VP_32  VPDEV0  [VPAC0]
VP_33  VPDEV0  [VPAC0]
VP_34  VPDEV0  [VPAC0]
VP_35  VPDEV1  [VPAC1]
VP_36  VPDEV0  [VPAC0]
VP_37  VPDEV0  [VPAC0]
VP_38  VPDEV0  [VPAC0]
VP_39  VPDEV0  [VPAC0]
VP_40  VPDEV0  [VPAC0]
VP_41  VPDEV0  [VPAC0]
VP_42  VPDEV0  [VPAC0]
VP_43  VPDEV2  [VPAC2]
VP_44  VPDEV0  [VPAC0]
VP_45  VPDEV0  [VPAC0]
VP_46  VPDEV0  [VPAC0]
VP_47  VPDEV0  [VPAC0]
VP_48  VPDEV0  [VPAC0]
VP_49  VPDEV0  [VPAC0]
VP_50  VPDEV3  [VPAC3]
VP_51  VPDEV3  [VPAC3]
VP_52  VPDEV4  [VPAC4]
VP_53  VPDEV3  [VPAC3]
VP_54  VPDEV0  [VPAC0]
VP_55  VPDEV0  [VPAC0]
VP_56  VPDEV0  [VPAC0]
VPS+233  Open  SJSJ_SMALLER  [SJ_1_SMALLER]
VPS-233  Open  SJSJ_SMALLER  [SJ_1_SMALLER]
VR1  AP1231-2.5V(SOT23-5)  AP1231-33  [SOT-23-5]